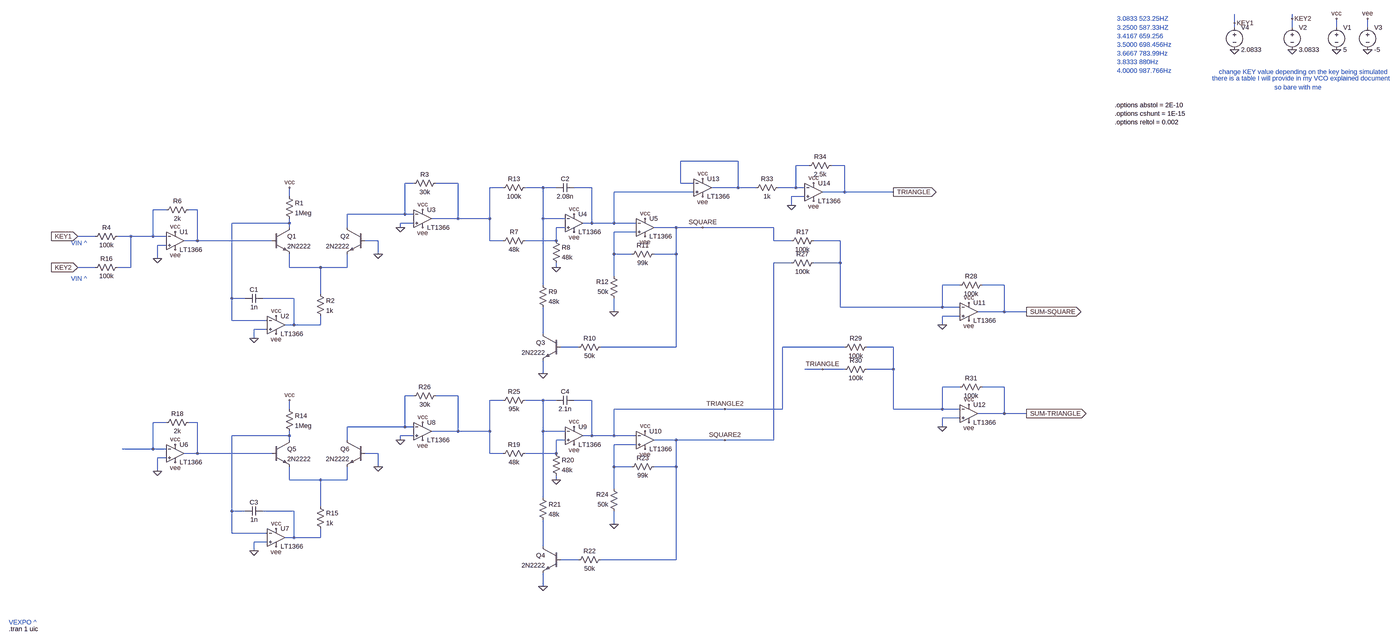
[diagram p0: schematic VCO_with_a_really_large_frequency_enshanter.asc, whole sheet]
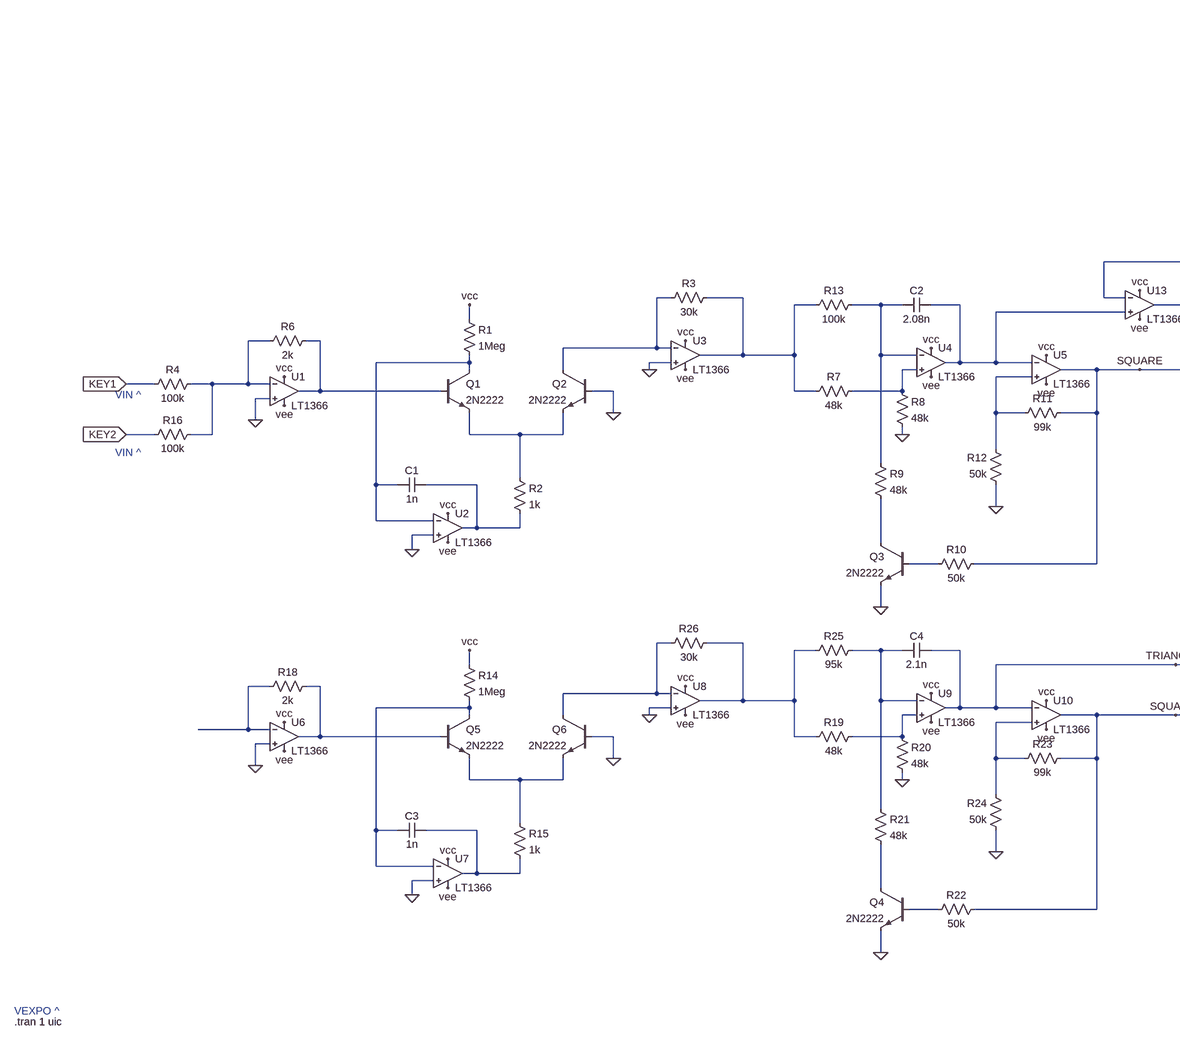
[diagram p1: schematic VCO_with_a_really_large_frequency_enshanter.asc, part, row 1 of 1, column 1 of 2]
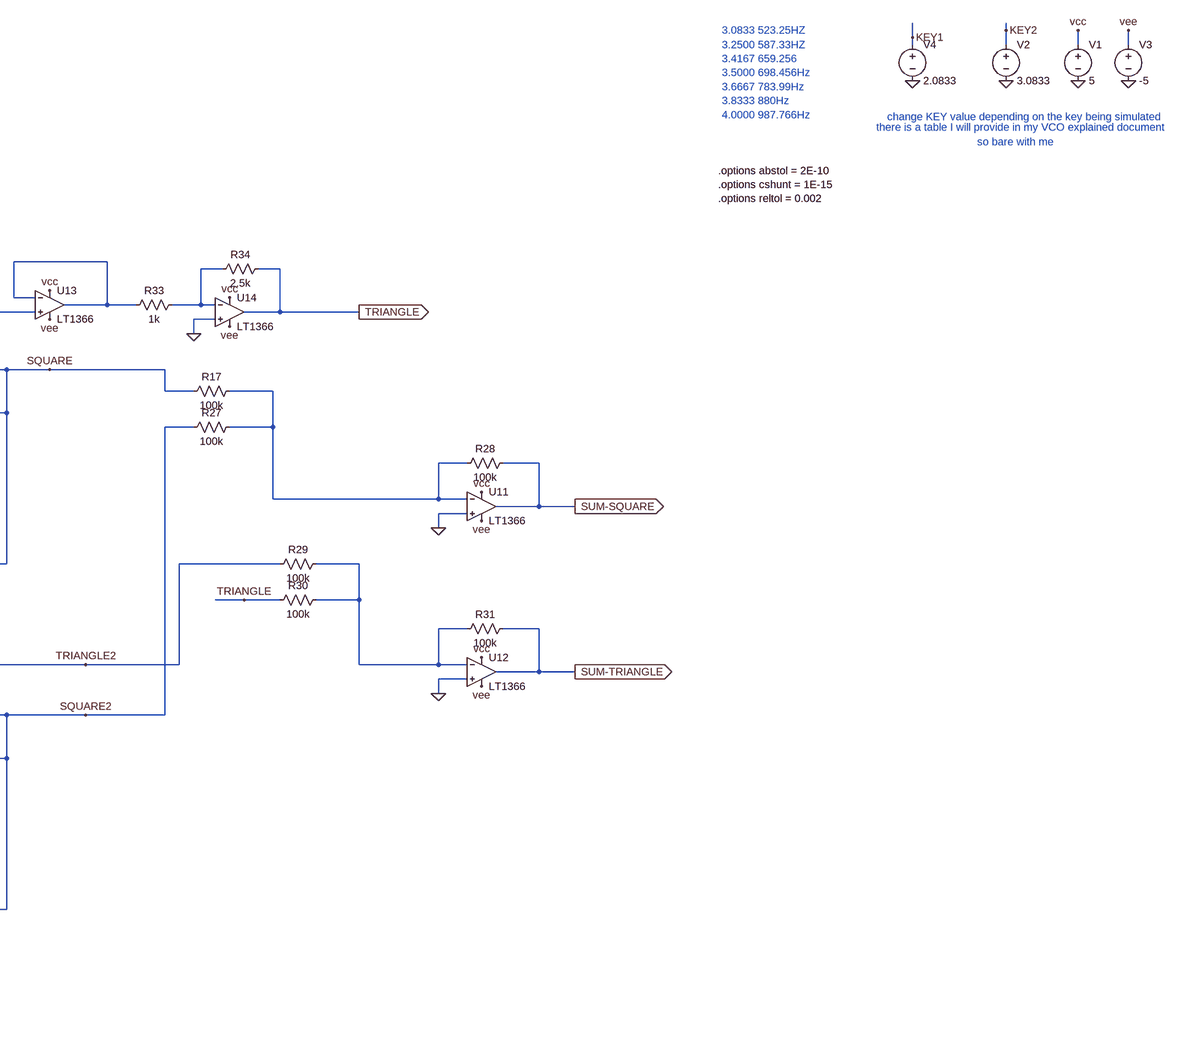
[diagram p2: schematic VCO_with_a_really_large_frequency_enshanter.asc, part, row 1 of 1, column 2 of 2]
VCO_with_a_really_large_frequency_enshanter.asc, the LTspice schematic file:
Version 4
SHEET 1 5164 1992
WIRE 4400 -784 4400 -800
WIRE 4192 -768 4192 -800
WIRE 4192 -752 4192 -768
WIRE 4400 -752 4400 -784
WIRE 4560 -752 4560 -784
WIRE 4672 -752 4672 -784
WIRE 1952 -256 1744 -256
WIRE 2208 -240 2160 -240
WIRE 2336 -240 2288 -240
WIRE 640 -176 608 -176
WIRE 800 -176 720 -176
WIRE 1744 -176 1744 -256
WIRE 1792 -176 1744 -176
WIRE 1104 -160 1056 -160
WIRE 1248 -160 1184 -160
WIRE 1296 -160 1248 -160
WIRE 1424 -160 1360 -160
WIRE 1952 -160 1952 -256
WIRE 1952 -160 1856 -160
WIRE 2016 -160 1952 -160
WIRE 2160 -160 2160 -240
WIRE 2160 -160 2096 -160
WIRE 2192 -160 2160 -160
WIRE 1792 -144 1504 -144
WIRE 2336 -144 2336 -240
WIRE 2336 -144 2256 -144
WIRE 2512 -144 2336 -144
WIRE 192 -128 192 -160
WIRE 2192 -128 2144 -128
WIRE 2144 -96 2144 -128
WIRE -352 -80 -400 -80
WIRE -240 -80 -272 -80
WIRE 608 -64 608 -176
WIRE 608 -64 400 -64
WIRE 640 -64 608 -64
WIRE 800 -48 800 -176
WIRE 800 -48 704 -48
WIRE 1056 -48 1056 -160
WIRE 1056 -48 800 -48
WIRE 1248 -48 1248 -160
WIRE 1328 -48 1248 -48
WIRE 192 -32 192 -48
WIRE 192 -32 -16 -32
WIRE 640 -32 592 -32
WIRE 1424 -32 1424 -160
WIRE 1424 -32 1392 -32
WIRE 1504 -32 1504 -144
WIRE 1504 -32 1424 -32
WIRE 1584 -32 1504 -32
WIRE 192 -16 192 -32
WIRE 400 -16 400 -64
WIRE 592 -16 592 -32
WIRE 1328 -16 1296 -16
WIRE 1728 -16 1648 -16
WIRE 1824 -16 1728 -16
WIRE 2080 -16 1824 -16
WIRE 1584 0 1504 0
WIRE -608 16 -672 16
WIRE -480 16 -528 16
WIRE -400 16 -400 -80
WIRE -400 16 -480 16
WIRE -352 16 -400 16
WIRE -240 32 -240 -80
WIRE -240 32 -288 32
WIRE 128 32 -240 32
WIRE 512 32 464 32
WIRE 1056 32 1056 -48
WIRE 1104 32 1056 32
WIRE 1296 32 1296 -16
WIRE 1296 32 1184 32
WIRE 2080 32 2080 -16
WIRE 2144 32 2080 32
WIRE 2320 32 2224 32
WIRE -352 48 -384 48
WIRE 512 80 512 32
WIRE 1504 80 1504 0
WIRE 1568 80 1504 80
WIRE 1728 80 1728 -16
WIRE 1728 80 1648 80
WIRE -384 96 -384 48
WIRE 2144 112 2080 112
WIRE 2320 112 2320 32
WIRE 2320 112 2224 112
WIRE -608 128 -672 128
WIRE -480 128 -480 16
WIRE -480 128 -528 128
WIRE 192 128 192 80
WIRE 304 128 192 128
WIRE 400 128 400 80
WIRE 400 128 304 128
WIRE 1296 128 1296 112
WIRE 1504 160 1504 80
WIRE 1248 192 1248 -48
WIRE 2752 192 2688 192
WIRE 2912 192 2832 192
WIRE 304 224 304 128
WIRE -16 240 -16 -32
WIRE 32 240 -16 240
WIRE 208 240 96 240
WIRE 2320 272 2320 112
WIRE 2688 272 2688 192
WIRE 2688 272 2320 272
WIRE 2752 272 2688 272
WIRE 1504 288 1504 240
WIRE 2912 288 2912 192
WIRE 2912 288 2816 288
WIRE 2992 288 2912 288
WIRE 2752 304 2688 304
WIRE -16 320 -16 240
WIRE 112 320 -16 320
WIRE 208 336 208 240
WIRE 208 336 176 336
WIRE 304 336 304 304
WIRE 304 336 208 336
WIRE 2688 336 2688 304
WIRE 112 352 64 352
WIRE 1248 368 1248 272
WIRE 64 384 64 352
WIRE 1376 416 1312 416
WIRE 1728 416 1728 80
WIRE 1728 416 1456 416
WIRE 2336 416 2112 416
WIRE 2512 416 2416 416
WIRE 2256 496 2192 496
WIRE 2336 496 2256 496
WIRE 2512 496 2512 416
WIRE 2512 496 2416 496
WIRE 1248 512 1248 464
WIRE 2752 560 2688 560
WIRE 2912 560 2832 560
WIRE 640 592 608 592
WIRE 800 592 720 592
WIRE 1104 608 1056 608
WIRE 1248 608 1184 608
WIRE 1296 608 1248 608
WIRE 1424 608 1360 608
WIRE 192 640 192 608
WIRE 1904 640 1504 640
WIRE 2112 640 2112 416
WIRE 2112 640 1904 640
WIRE 2512 640 2512 496
WIRE 2688 640 2688 560
WIRE 2688 640 2512 640
WIRE 2752 640 2688 640
WIRE 2912 656 2912 560
WIRE 2912 656 2816 656
WIRE 2992 656 2912 656
WIRE 2752 672 2688 672
WIRE -352 688 -400 688
WIRE -240 688 -272 688
WIRE 608 704 608 592
WIRE 608 704 400 704
WIRE 640 704 608 704
WIRE 2688 704 2688 672
WIRE 800 720 800 592
WIRE 800 720 704 720
WIRE 1056 720 1056 608
WIRE 1056 720 800 720
WIRE 1248 720 1248 608
WIRE 1328 720 1248 720
WIRE 192 736 192 720
WIRE 192 736 -16 736
WIRE 640 736 592 736
WIRE 1424 736 1424 608
WIRE 1424 736 1392 736
WIRE 1504 736 1504 640
WIRE 1504 736 1424 736
WIRE 1584 736 1504 736
WIRE 192 752 192 736
WIRE 400 752 400 704
WIRE 592 752 592 736
WIRE 1328 752 1296 752
WIRE 1728 752 1648 752
WIRE 1904 752 1728 752
WIRE 2080 752 2080 112
WIRE 2080 752 1904 752
WIRE 1584 768 1504 768
WIRE -400 784 -400 688
WIRE -400 784 -512 784
WIRE -352 784 -400 784
WIRE -240 800 -240 688
WIRE -240 800 -288 800
WIRE 128 800 -240 800
WIRE 512 800 464 800
WIRE 1056 800 1056 720
WIRE 1104 800 1056 800
WIRE 1296 800 1296 752
WIRE 1296 800 1184 800
WIRE -352 816 -384 816
WIRE 512 848 512 800
WIRE 1504 848 1504 768
WIRE 1568 848 1504 848
WIRE 1728 848 1728 752
WIRE 1728 848 1648 848
WIRE -384 864 -384 816
WIRE 192 896 192 848
WIRE 304 896 192 896
WIRE 400 896 400 848
WIRE 400 896 304 896
WIRE 1296 896 1296 880
WIRE 1504 928 1504 848
WIRE 1248 960 1248 720
WIRE 304 992 304 896
WIRE -16 1008 -16 736
WIRE 32 1008 -16 1008
WIRE 208 1008 96 1008
WIRE 1504 1056 1504 1008
WIRE -16 1088 -16 1008
WIRE 112 1088 -16 1088
WIRE 208 1104 208 1008
WIRE 208 1104 176 1104
WIRE 304 1104 304 1072
WIRE 304 1104 208 1104
WIRE 112 1120 64 1120
WIRE 1248 1136 1248 1040
WIRE 64 1152 64 1120
WIRE 1376 1184 1312 1184
WIRE 1728 1184 1728 848
WIRE 1728 1184 1456 1184
WIRE 1248 1280 1248 1232
FLAG 512 80 0
FLAG 192 -160 vcc
FLAG 64 384 0
FLAG 592 -16 0
FLAG 672 -80 vcc
FLAG 4560 -672 0
FLAG 4560 -784 vcc
FLAG 4672 -672 0
FLAG 4672 -784 vee
FLAG 672 -16 vee
FLAG 144 304 vcc
FLAG 144 368 vee
FLAG -320 0 vcc
FLAG -384 96 0
FLAG -672 16 KEY1
IOPIN -672 16 In
FLAG 1360 -64 vcc
FLAG 1616 -48 vcc
FLAG 2512 -144 TRIANGLE
IOPIN 2512 -144 Out
FLAG 1296 128 0
FLAG 1248 512 0
FLAG 1504 288 0
FLAG 1616 16 vee
FLAG 1360 0 vee
FLAG -320 64 vee
FLAG 512 848 0
FLAG 192 608 vcc
FLAG 64 1152 0
FLAG 592 752 0
FLAG 672 688 vcc
FLAG 672 752 vee
FLAG 144 1072 vcc
FLAG 144 1136 vee
FLAG -320 768 vcc
FLAG -384 864 0
FLAG -672 128 KEY2
IOPIN -672 128 In
FLAG 1360 704 vcc
FLAG 1616 720 vcc
FLAG 1904 640 TRIANGLE2
FLAG 1296 896 0
FLAG 1248 1280 0
FLAG 1504 1056 0
FLAG 1616 784 vee
FLAG 1360 768 vee
FLAG -320 832 vee
FLAG 2688 336 0
FLAG 2784 256 vcc
FLAG 2784 320 vee
FLAG 2992 288 SUM-SQUARE
IOPIN 2992 288 Out
FLAG 2688 704 0
FLAG 2784 624 vcc
FLAG 2784 688 vee
FLAG 2992 656 SUM-TRIANGLE
IOPIN 2992 656 Out
FLAG 1824 -16 SQUARE
FLAG 1904 752 SQUARE2
FLAG 1824 -192 vcc
FLAG 1824 -128 vee
FLAG 2144 -96 0
FLAG 2224 -176 vcc
FLAG 2224 -112 vee
FLAG 2256 496 TRIANGLE
FLAG 4192 -672 0
FLAG 4400 -672 0
FLAG 4400 -784 KEY2
FLAG 4192 -768 KEY1
SYMBOL res 176 -144 R0
SYMATTR InstName R1
SYMATTR Value 1Meg
SYMBOL cap 96 224 R90
WINDOW 0 0 32 VBottom 2
WINDOW 3 32 32 VTop 2
SYMATTR InstName C1
SYMATTR Value 1n
SYMBOL res 288 208 R0
SYMATTR InstName R2
SYMATTR Value 1k
SYMBOL res 736 -192 R90
WINDOW 0 0 56 VBottom 2
WINDOW 3 32 56 VTop 2
SYMATTR InstName R3
SYMATTR Value 30k
SYMBOL voltage 4560 -768 R0
SYMATTR InstName V1
SYMATTR Value 5
SYMBOL voltage 4672 -768 R0
SYMATTR InstName V3
SYMATTR Value -5
SYMBOL res -512 0 R90
WINDOW 0 0 56 VBottom 2
WINDOW 3 32 56 VTop 2
SYMATTR InstName R4
SYMATTR Value 100k
SYMBOL res -256 -96 R90
WINDOW 0 0 56 VBottom 2
WINDOW 3 32 56 VTop 2
SYMATTR InstName R6
SYMATTR Value 2k
SYMBOL cap 1360 -176 R90
WINDOW 0 0 32 VBottom 2
WINDOW 3 32 32 VTop 2
SYMATTR InstName C2
SYMATTR Value 2.08n
SYMBOL res 1200 16 R90
WINDOW 0 0 56 VBottom 2
WINDOW 3 32 56 VTop 2
SYMATTR InstName R7
SYMATTR Value 48k
SYMBOL res 1280 16 R0
SYMATTR InstName R8
SYMATTR Value 48k
SYMBOL res 1232 176 R0
SYMATTR InstName R9
SYMATTR Value 48k
SYMBOL npn 1312 368 M0
SYMATTR InstName Q3
SYMATTR Value 2N2222
SYMBOL res 1472 400 R90
WINDOW 0 0 56 VBottom 2
WINDOW 3 32 56 VTop 2
SYMATTR InstName R10
SYMATTR Value 50k
SYMBOL res 1664 64 R90
WINDOW 0 0 56 VBottom 2
WINDOW 3 32 56 VTop 2
SYMATTR InstName R11
SYMATTR Value 99k
SYMBOL res 1520 256 R180
WINDOW 0 36 76 Left 2
WINDOW 3 36 40 Left 2
SYMATTR InstName R12
SYMATTR Value 50k
SYMBOL res 1200 -176 R90
WINDOW 0 0 56 VBottom 2
WINDOW 3 32 56 VTop 2
SYMATTR InstName R13
SYMATTR Value 100k
SYMBOL npn 128 -16 R0
SYMATTR InstName Q1
SYMATTR Value 2N2222
SYMBOL npn 464 -16 M0
SYMATTR InstName Q2
SYMATTR Value 2N2222
SYMBOL Opamps\\LT1366 -320 -32 R0
SYMATTR InstName U1
SYMBOL Opamps\\LT1366 144 272 R0
SYMATTR InstName U2
SYMBOL Opamps\\LT1366 672 -112 R0
SYMATTR InstName U3
SYMBOL Opamps\\LT1366 1360 -96 R0
SYMATTR InstName U4
SYMBOL Opamps\\LT1366 1616 -80 R0
SYMATTR InstName U5
SYMBOL res 176 624 R0
SYMATTR InstName R14
SYMATTR Value 1Meg
SYMBOL cap 96 992 R90
WINDOW 0 0 32 VBottom 2
WINDOW 3 32 32 VTop 2
SYMATTR InstName C3
SYMATTR Value 1n
SYMBOL res 288 976 R0
SYMATTR InstName R15
SYMATTR Value 1k
SYMBOL res -512 112 R90
WINDOW 0 0 56 VBottom 2
WINDOW 3 32 56 VTop 2
SYMATTR InstName R16
SYMATTR Value 100k
SYMBOL res -256 672 R90
WINDOW 0 0 56 VBottom 2
WINDOW 3 32 56 VTop 2
SYMATTR InstName R18
SYMATTR Value 2k
SYMBOL cap 1360 592 R90
WINDOW 0 0 32 VBottom 2
WINDOW 3 32 32 VTop 2
SYMATTR InstName C4
SYMATTR Value 2.1n
SYMBOL res 1200 784 R90
WINDOW 0 0 56 VBottom 2
WINDOW 3 32 56 VTop 2
SYMATTR InstName R19
SYMATTR Value 48k
SYMBOL res 1280 784 R0
SYMATTR InstName R20
SYMATTR Value 48k
SYMBOL res 1232 944 R0
SYMATTR InstName R21
SYMATTR Value 48k
SYMBOL npn 1312 1136 M0
SYMATTR InstName Q4
SYMATTR Value 2N2222
SYMBOL res 1472 1168 R90
WINDOW 0 0 56 VBottom 2
WINDOW 3 32 56 VTop 2
SYMATTR InstName R22
SYMATTR Value 50k
SYMBOL res 1664 832 R90
WINDOW 0 0 56 VBottom 2
WINDOW 3 32 56 VTop 2
SYMATTR InstName R23
SYMATTR Value 99k
SYMBOL res 1520 1024 R180
WINDOW 0 36 76 Left 2
WINDOW 3 36 40 Left 2
SYMATTR InstName R24
SYMATTR Value 50k
SYMBOL res 1200 592 R90
WINDOW 0 0 56 VBottom 2
WINDOW 3 32 56 VTop 2
SYMATTR InstName R25
SYMATTR Value 95k
SYMBOL npn 128 752 R0
SYMATTR InstName Q5
SYMATTR Value 2N2222
SYMBOL npn 464 752 M0
SYMATTR InstName Q6
SYMATTR Value 2N2222
SYMBOL Opamps\\LT1366 -320 736 R0
SYMATTR InstName U6
SYMBOL Opamps\\LT1366 144 1040 R0
SYMATTR InstName U7
SYMBOL Opamps\\LT1366 672 656 R0
SYMATTR InstName U8
SYMBOL Opamps\\LT1366 1360 672 R0
SYMATTR InstName U9
SYMBOL Opamps\\LT1366 1616 688 R0
SYMATTR InstName U10
SYMBOL res 736 576 R90
WINDOW 0 0 56 VBottom 2
WINDOW 3 32 56 VTop 2
SYMATTR InstName R26
SYMATTR Value 30k
SYMBOL Opamps\\LT1366 2784 224 R0
SYMATTR InstName U11
SYMBOL res 2240 16 R90
WINDOW 0 0 56 VBottom 2
WINDOW 3 32 56 VTop 2
SYMATTR InstName R17
SYMATTR Value 100k
SYMBOL res 2240 96 R90
WINDOW 0 0 56 VBottom 2
WINDOW 3 32 56 VTop 2
SYMATTR InstName R27
SYMATTR Value 100k
SYMBOL res 2848 176 R90
WINDOW 0 0 56 VBottom 2
WINDOW 3 32 56 VTop 2
SYMATTR InstName R28
SYMATTR Value 100k
SYMBOL Opamps\\LT1366 2784 592 R0
SYMATTR InstName U12
SYMBOL res 2432 400 R90
WINDOW 0 0 56 VBottom 2
WINDOW 3 32 56 VTop 2
SYMATTR InstName R29
SYMATTR Value 100k
SYMBOL res 2432 480 R90
WINDOW 0 0 56 VBottom 2
WINDOW 3 32 56 VTop 2
SYMATTR InstName R30
SYMATTR Value 100k
SYMBOL res 2848 544 R90
WINDOW 0 0 56 VBottom 2
WINDOW 3 32 56 VTop 2
SYMATTR InstName R31
SYMATTR Value 100k
SYMBOL Opamps\\LT1366 1824 -224 R0
SYMATTR InstName U13
SYMBOL Opamps\\LT1366 2224 -208 R0
SYMATTR InstName U14
SYMBOL res 2112 -176 R90
WINDOW 0 0 56 VBottom 2
WINDOW 3 32 56 VTop 2
SYMATTR InstName R33
SYMATTR Value 1k
SYMBOL res 2304 -256 R90
WINDOW 0 0 56 VBottom 2
WINDOW 3 32 56 VTop 2
SYMATTR InstName R34
SYMATTR Value 2.5k
SYMBOL voltage 4400 -768 R0
SYMATTR InstName V2
SYMATTR Value 3.0833
SYMBOL voltage 4192 -768 R0
SYMATTR InstName V4
SYMATTR Value 2.0833
TEXT -696 40 Left 2 ;VIN ^
TEXT 4136 -592 Left 2 ;change KEY value depending on the key being simulated
TEXT 4112 -568 Left 2 ;there is a table I will provide in my VCO explained document
TEXT 4336 -536 Left 2 ;so bare with me
TEXT -920 1952 Left 2 ;VEXPO ^
TEXT -696 168 Left 2 ;VIN ^
TEXT 3768 -784 Left 2 ;3.0833 523.25HZ
TEXT 3768 -752 Left 2 ;3.2500 587.33HZ\n3.4167 659.256\n3.5000 698.456Hz\n3.6667 783.99Hz\n3.8333 880Hz\n4.0000 987.766Hz
TEXT -920 1976 Left 2 !.tran 1 uic
TEXT 3760 -472 Left 2 !.options abstol = 2E-10\n.options cshunt = 1E-15\n.options reltol = 0.002

The netlist it stands for:
* VCO_with_a_really_large_frequency_enshanter.asc
R1 vcc N009 1Meg
C1 N014 N009 1n
R2 N013 N014 1k
R3 N004 N003 30k
V1 vcc 0 5
V3 vee 0 -5
R4 N007 KEY1 100k
R6 N008 N007 2k
C2 N006 N005 2.08n
R7 N010 N004 48k
R8 N010 0 48k
R9 N005 N015 48k
Q3 N015 N016 0 0 2N2222
R10 SQUARE N016 50k
R11 SQUARE N011 99k
R12 0 N011 50k
R13 N005 N004 100k
Q1 N009 N008 N013 0 2N2222
Q2 N003 0 N013 0 2N2222
XU1 0 N007 vcc vee N008 LT1366  ; pins In+ In- V+ V- OUT
XU2 0 N009 vcc vee N014 LT1366  ; pins In+ In- V+ V- OUT
XU3 0 N003 vcc vee N004 LT1366  ; pins In+ In- V+ V- OUT
XU4 N010 N005 vcc vee N006 LT1366  ; pins In+ In- V+ V- OUT
XU5 N011 N006 vcc vee SQUARE LT1366  ; pins In+ In- V+ V- OUT
R14 vcc N023 1Meg
C3 N027 N023 1n
R15 N026 N027 1k
R16 N007 KEY2 100k
R18 N022 N021 2k
C4 TRIANGLE2 N020 2.1n
R19 N024 N019 48k
R20 N024 0 48k
R21 N020 N028 48k
Q4 N028 N029 0 0 2N2222
R22 SQUARE2 N029 50k
R23 SQUARE2 N025 99k
R24 0 N025 50k
R25 N020 N019 95k
Q5 N023 N022 N026 0 2N2222
Q6 N018 0 N026 0 2N2222
XU6 0 N021 vcc vee N022 LT1366  ; pins In+ In- V+ V- OUT
XU7 0 N023 vcc vee N027 LT1366  ; pins In+ In- V+ V- OUT
XU8 0 N018 vcc vee N019 LT1366  ; pins In+ In- V+ V- OUT
XU9 N024 N020 vcc vee TRIANGLE2 LT1366  ; pins In+ In- V+ V- OUT
XU10 N025 TRIANGLE2 vcc vee SQUARE2 LT1366  ; pins In+ In- V+ V- OUT
R26 N019 N018 30k
XU11 0 N012 vcc vee SUM-SQUARE LT1366  ; pins In+ In- V+ V- OUT
R17 N012 SQUARE 100k
R27 N012 SQUARE2 100k
R28 SUM-SQUARE N012 100k
XU12 0 N017 vcc vee SUM-TRIANGLE LT1366  ; pins In+ In- V+ V- OUT
R29 N017 TRIANGLE2 100k
R30 N017 TRIANGLE 100k
R31 SUM-TRIANGLE N017 100k
XU13 N006 N001 vcc vee N001 LT1366  ; pins In+ In- V+ V- OUT
XU14 0 N002 vcc vee TRIANGLE LT1366  ; pins In+ In- V+ V- OUT
R33 N002 N001 1k
R34 TRIANGLE N002 2.5k
V2 KEY2 0 3.0833
V4 KEY1 0 2.0833
.model NPN NPN
.model PNP PNP
.lib standard.bjt
* VIN ^
* change KEY value depending on the key being simulated
* there is a table I will provide in my VCO explained document
* so bare with me
* VEXPO ^
* VIN ^
* 3.0833 523.25HZ
* 3.2500 587.33HZ
* 3.4167 659.256
* 3.5000 698.456Hz
* 3.6667 783.99Hz
* 3.8333 880Hz
* 4.0000 987.766Hz
.tran 1 uic
.options abstol = 2E-10
.options cshunt = 1E-15
.options reltol = 0.002
.lib LTC.lib
.backanno
.end